# EAGLE design fullprop (EAGLE 8.1.0)
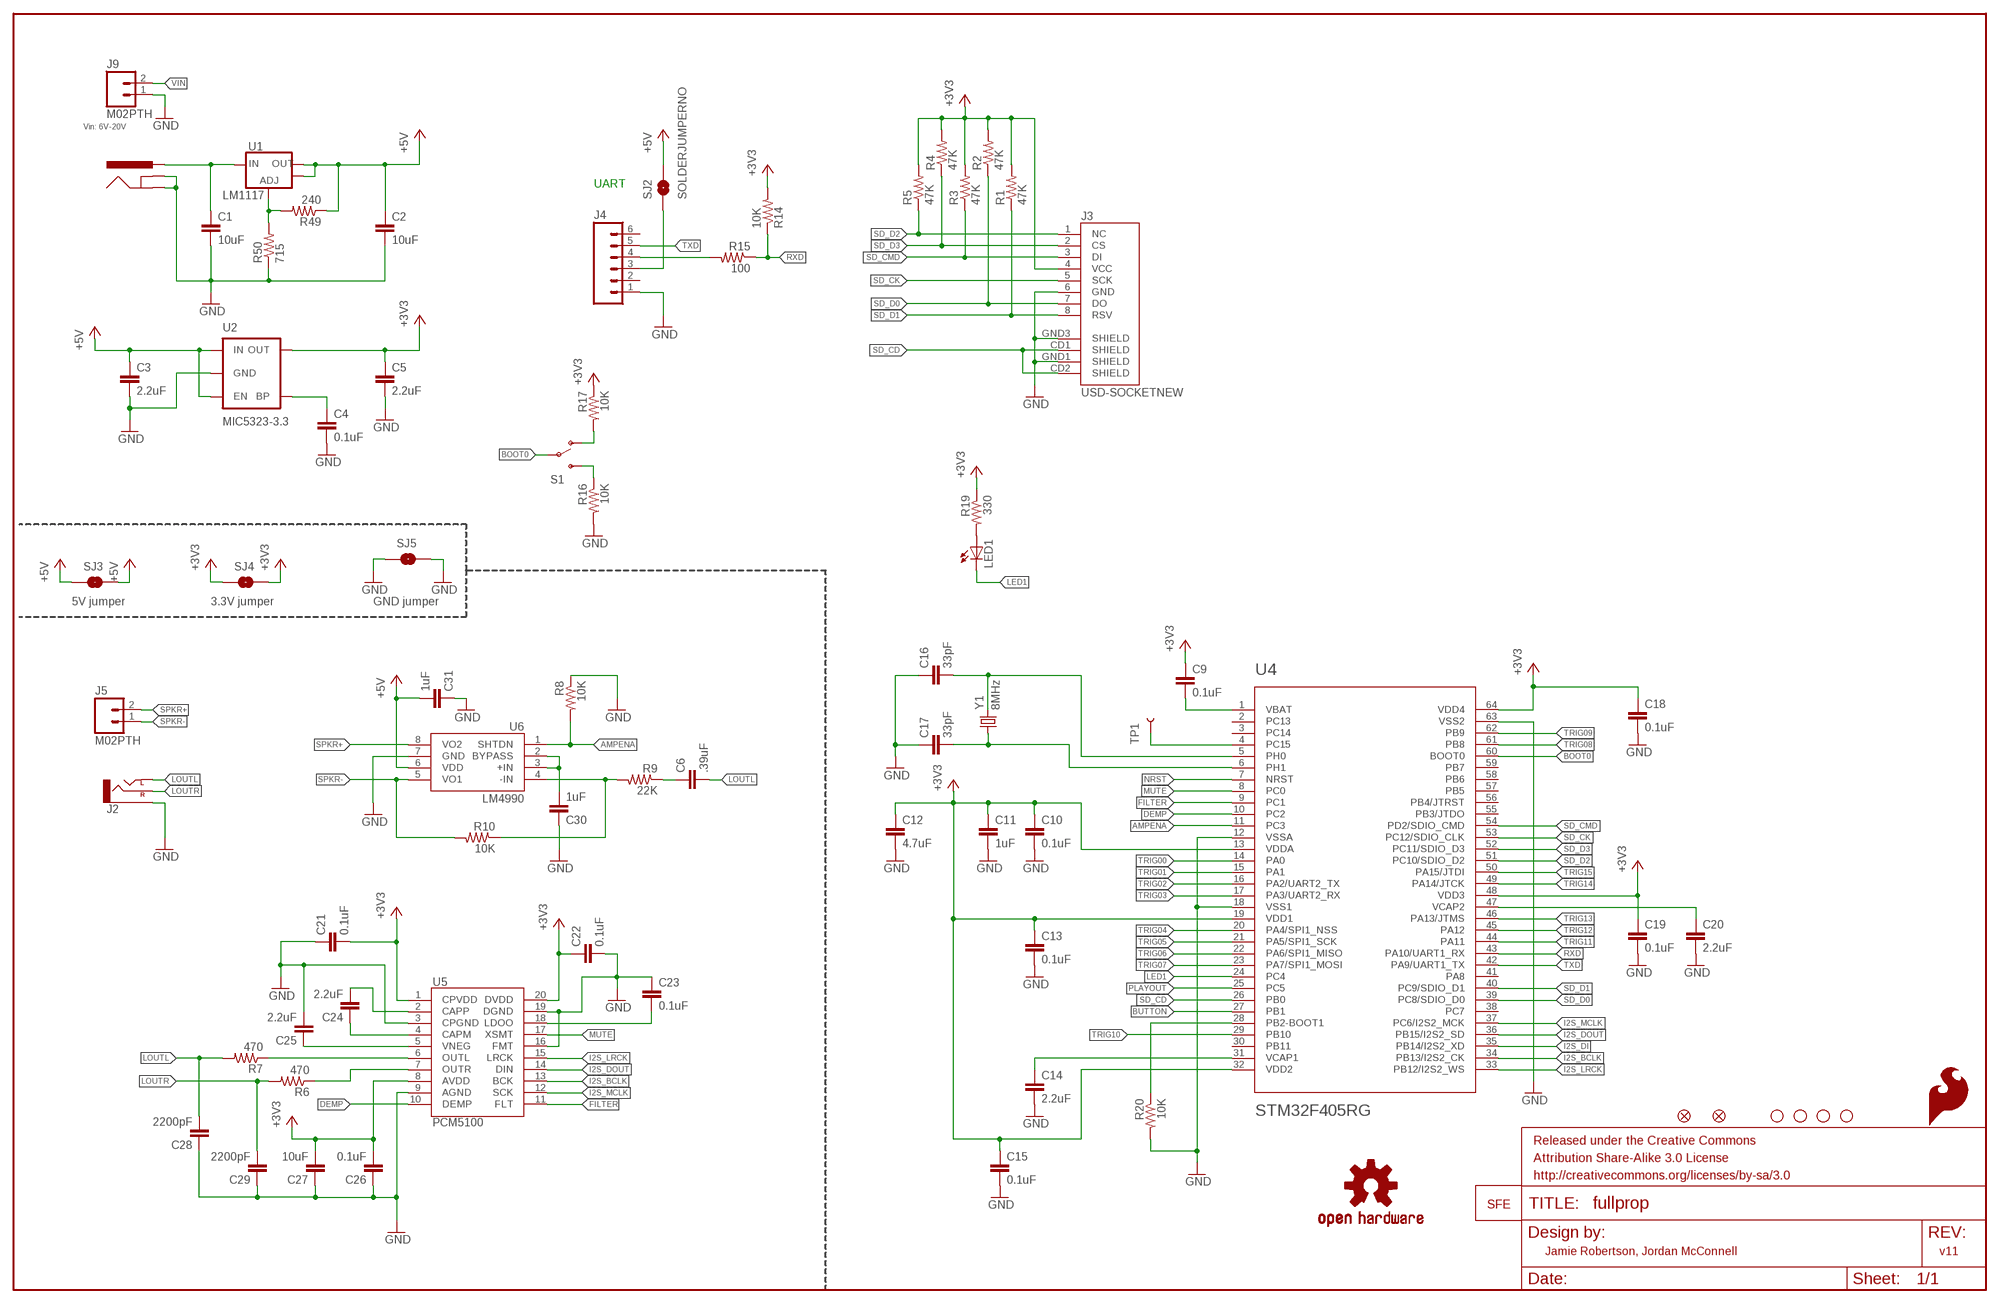
[diagram p0: schematic, sheet 1]

## Parts
C1  10uF  10UF50V20%(1210)  [1210]
C2  10uF  1UF-25V-10%(0805)  [0805]
C3  2.2uF  1UF-25V-10%(0805)  [0805]
C4  0.1uF  CAP0603-CAP  [0603-CAP]
C5  2.2uF  1UF-25V-10%(0805)  [0805]
C6  .39uF  CAP0603-CAP  [0603-CAP]
C9  0.1uF  CAP0603-CAP  [0603-CAP]
C10  0.1uF  CAP0603-CAP  [0603-CAP]
C11  1uF  CAP0603-CAP  [0603-CAP]
C12  4.7uF  CAP0603-CAP  [0603-CAP]
C13  0.1uF  CAP0603-CAP  [0603-CAP]
C14  2.2uF  CAP0603-CAP  [0603-CAP]
C15  0.1uF  CAP0603-CAP  [0603-CAP]
C16  33pF  CAP0603-CAP  [0603-CAP]
C17  33pF  CAP0603-CAP  [0603-CAP]
C18  0.1uF  CAP0603-CAP  [0603-CAP]
C19  0.1uF  CAP0603-CAP  [0603-CAP]
C20  2.2uF  CAP0603-CAP  [0603-CAP]
C21  0.1uF  CAP0603-CAP  [0603-CAP]
C22  0.1uF  CAP0603-CAP  [0603-CAP]
C23  0.1uF  CAP0603-CAP  [0603-CAP]
C24  2.2uF  CAP0603-CAP  [0603-CAP]
C25  2.2uF  CAP0603-CAP  [0603-CAP]
C26  0.1uF  CAP0603-CAP  [0603-CAP]
C27  10uF  CAP0603-CAP  [0603-CAP]
C28  2200pF  CAP0603-CAP  [0603-CAP]
C29  2200pF  CAP0603-CAP  [0603-CAP]
C30  1uF  CAP0603-CAP  [0603-CAP]
C31  1uF  CAP0603-CAP  [0603-CAP]
FID1  FIDUCIAL1X2  [FIDUCIAL-1X2]
FID2  FIDUCIAL1X2  [FIDUCIAL-1X2]
FRAME2  FRAME-LEDGER  [CREATIVE_COMMONS]
J1  5.5x2.1mm Barrel  POWER_JACKOVERPASTE_REDBOARD_0603  [POWER_JACK_SMD_OVERPASTE_REDBOARD_0603]
J2  AUDIO-JACKSMD2  [AUDIO-JACK-3.5MM-SMD]
J3  USD-SOCKETNEW  [MICRO-SD-SOCKET-PP]
J4  M06SIP  [1X06]
J5  M02PTH  [1X02]
J9  M02PTH  [1X02]
LED1  LED0603  [LED-0603]
LOGO1  OSHW-LOGOL  [OSHW-LOGO-L]
LOGO2  LOGO-SFENEW  [SFE-NEW-WEBLOGO]
LOGO4  SFE_LOGO_FLAME.2_INCH  [SFE_LOGO_FLAME_.2]
R1  47K  RESISTOR0603-RES  [0603-RES]
R2  47K  RESISTOR0603-RES  [0603-RES]
R3  47K  RESISTOR0603-RES  [0603-RES]
R4  47K  RESISTOR0603-RES  [0603-RES]
R5  47K  RESISTOR0603-RES  [0603-RES]
R6  470  RESISTOR0603-RES  [0603-RES]
R7  470  RESISTOR0603-RES  [0603-RES]
R8  10K  RESISTOR0603-RES  [0603-RES]
R9  22K  RESISTOR0603-RES  [0603-RES]
R10  10K  RESISTOR0603-RES  [0603-RES]
R14  10K  RESISTOR0603-RES  [0603-RES]
R15  100  RESISTOR0603-RES  [0603-RES]
R16  10K  RESISTOR0603-RES  [0603-RES]
R17  10K  RESISTOR0603-RES  [0603-RES]
R19  330  RESISTOR0603-RES  [0603-RES]
R20  10K  RESISTOR0603-RES  [0603-RES]
R49  240  240OHM1/10W1%(0603)  [0603-RES]
R50  715  RESISTOR0603  [0603-RES]
S1  SWITCH-SPDT-SMD-A  [SWITCH-SPST-SMD-A]
SJ2  SOLDERJUMPERNO  [SJ_2S-NO]
SJ3  SOLDERJUMPERTRACE  [SJ_2S-TRACE]
SJ4  SOLDERJUMPERTRACE  [SJ_2S-TRACE]
SJ5  SOLDERJUMPERTRACE  [SJ_2S-TRACE]
STANDOFF1  STAND-OFF  [STAND-OFF]
STANDOFF2  STAND-OFF  [STAND-OFF]
STANDOFF3  STAND-OFF  [STAND-OFF]
STANDOFF4  STAND-OFF  [STAND-OFF]
TP1  TEST-POINTTP_15TH_THRU  [TP_15TH]
U1  V_REG_LM1117SOT223  [SOT223]
U2  MIC5323-3.3  MIC52053.3V  [SOT23-5]
U4  STM32F405RG  [TQFP64]
U5  PCM5100  [PW_R-PDSO-G20]
U6  LM4990  [S-PDSO-G08]
Y1  8MHz  CRYSTALSMD  [HC49UP]

## Nets
+5V: C2.1 C3.1 C31.2 R49.1 SJ2.2 SJ3.1 SJ3.2 U1.2(OUT) U1.4(OUT) U2.1(IN) U2.3(EN) U6.6(VDD)
AMPENA: R8.2 U4.11(PC3) U6.1(SHTDN)
BOOT0: S1.2(P) U4.60(BOOT0)
BUTTON: U4.27(PB1)
DEMP: U4.10(PC2) U5.10(DEMP)
FILTER: U4.9(PC1) U5.11(FLT)
GND: C1.2 C2.2 C3.2 C4.2 C5.2 C10.2 C11.2 C12.2 C13.2 C14.2 C15.2 C16.1 C17.1 C18.2 C19.2 C20.2 C21.1 C22.2 C23.1 C25.2 C26.1 C27.1 C28.1 C29.1 C30.1 C31.1 J1.GND(GNDBREAK) J1.P$4(GND) J2.SLEEVE J3.6(GND) J3.GND1(SHIELD) J3.GND3(SHIELD) J4.1 J9.1 R8.1 R16.2 R20.2 R50.1 SJ5.1 SJ5.2 U2.2(GND) U4.12(VSSA) U4.18(VSS1) U4.63(VSS2) U5.3(CPGND) U5.9(AGND) U5.16(FMT) U5.19(DGND) U6.7(GND)
I2S_BCLK: U4.34(PB13/I2S2_CK) U5.13(BCK)
I2S_DI: U4.35(PB14/I2S2_XD)
I2S_DOUT: U4.36(PB15/I2S2_SD) U5.14(DIN)
I2S_LRCK: U4.33(PB12/I2S2_WS) U5.15(LRCK)
I2S_MCLK: U4.37(PC6/I2S2_MCK) U5.12(SCK)
LED1: LED1.C U4.24(PC4)
LOUTL: C6.2 C28.2 J2.TIP(LEFT) R7.2
LOUTR: C29.2 J2.RING(RIGHT) R6.2
MUTE: U4.8(PC0) U5.17(XSMT)
N$2: C4.1 U2.4(BP)
N$3: C9.2 U4.1(VBAT)
N$4: C14.1 U4.31(VCAP1)
N$5: C16.2 U4.5(PH0) Y1.2
N$6: C17.2 U4.6(PH1) Y1.1
N$7: R16.1 S1.3(S)
N$8: C20.1 U4.47(VCAP2)
N$9: J4.4 R15.2
N$10: R17.2 S1.1(O)
N$11: LED1.A R19.2
N$12: R20.1 U4.28(PB2-BOOT1)
N$13: R49.2 R50.2 U1.1(ADJ)
N$14: C23.2 U5.18(LDOO)
N$15: R6.1 U5.7(OUTR)
N$16: C24.2 U5.2(CAPP)
N$17: C24.1 U5.4(CAPM)
N$18: C25.1 U5.5(VNEG)
N$19: R7.1 U5.6(OUTL)
N$20: C30.2 U6.2(BYPASS) U6.3(+IN)
N$21: C6.1 R9.1
N$22: TP1.P$1 U4.4(PC15)
N$29: R9.2 R10.1 U6.4(-IN)
N$32: J4.3 SJ2.1
NRST: U4.7(NRST)
PLAYOUT: U4.25(PC5)
RXD: R14.1 R15.1 U4.43(PA10/UART1_RX)
SD_CD: J3.CD1(SHIELD) J3.CD2(SHIELD) U4.26(PB0)
SD_CK: J3.5(SCK) U4.53(PC12/SDIO_CLK)
SD_CMD: J3.3(DI) R3.1 U4.54(PD2/SDIO_CMD)
SD_D0: J3.7(DO) R2.1 U4.39(PC8/SDIO_D0)
SD_D1: J3.8(RSV) R1.1 U4.40(PC9/SDIO_D1)
SD_D2: J3.1(NC) R5.1 U4.51(PC10/SDIO_D2)
SD_D3: J3.2(CS) R4.1 U4.52(PC11/SDIO_D3)
SPKR+: J5.2 U6.8(VO2)
SPKR-: J5.1 R10.2 U6.5(VO1)
TRIG00: U4.14(PA0)
TRIG01: U4.15(PA1)
TRIG02: U4.16(PA2/UART2_TX)
TRIG03: U4.17(PA3/UART2_RX)
TRIG04: U4.20(PA4/SPI1_NSS)
TRIG05: U4.21(PA5/SPI1_SCK)
TRIG06: U4.22(PA6/SPI1_MISO)
TRIG07: U4.23(PA7/SPI1_MOSI)
TRIG08: U4.61(PB8)
TRIG09: U4.62(PB9)
TRIG10: U4.29(PB10)
TRIG11: U4.44(PA11)
TRIG12: U4.45(PA12)
TRIG13: U4.46(PA13/JTMS)
TRIG14: U4.49(PA14/JTCK)
TRIG15: U4.50(PA15/JTDI)
TXD: J4.5 U4.42(PA9/UART1_TX)
VCC: C5.1 C9.1 C10.1 C11.1 C12.1 C13.1 C15.1 C18.1 C19.1 C21.2 C22.1 C26.2 C27.2 J3.4(VCC) R1.2 R2.2 R3.2 R4.2 R5.2 R14.2 R17.1 R19.1 SJ4.1 SJ4.2 U2.5(OUT) U4.13(VDDA) U4.19(VDD1) U4.32(VDD2) U4.48(VDD3) U4.64(VDD4) U5.1(CPVDD) U5.8(AVDD) U5.20(DVDD) ; supply symbol labelled +3V3
VIN: C1.1 J1.VIN0(PWR) J9.2 U1.3(IN)
Unconnected: J4.2 J4.6 U4.2(PC13) U4.3(PC14) U4.30(PB11) U4.38(PC7) U4.41(PA8) U4.55(PB3/JTDO) U4.56(PB4/JTRST) U4.57(PB5) U4.58(PB6) U4.59(PB7)

## Notes on the sheet
- Vin: 6V-20V
- UART
- LM1117
- 5V jumper | 3.3V jumper | GND jumper
- Jamie Robertson, Jordan McConnell | v11

## Library data of the parts
C1 = SparkFun-Capacitors:10UF50V20%(1210): CAP-09824; PROD_ID: CAP-09824
C2 C3 C5 = SparkFun-Capacitors:1UF-25V-10%(0805): CAP-08064; PROD_ID: CAP-08064; VALUE: 1uF
C4 C6 C9-C31 = SparkFun-Capacitors:CAP: Capacitor Standard 0603 ceramic capacitor, and 0.1" leaded capacitor.
FID1 FID2 = SparkFun-Aesthetics:FIDUCIAL: Fiducial Alignment Points Various fiducial points for machine vision alignment.
FRAME2 = SparkFun-Aesthetics:FRAME-LEDGER: Schematic Frame Standard 11x14 US Ledger frame
J1 = Testing:POWER_JACK: Power Jack This is the standard 5.5mm barrel jack for power. The PTH is the most common, proven, reliable, footprint. All others are experimental. The Slot footprint only works if the mill layer is transmitted to the PCB fab house so be warned. Spark Fun Electronics SKU : PRT-00119. Mating wall wart : TOL-00298 (and others)
J2 = SparkFun-Connectors:AUDIO-JACK: 3.5mm Audio Jack Simple 3.5mm common PCB mount audio jack. SKU: PRT-08032
J3 = robertsonics:USD-SOCKET: microSD Socket Push-push type uSD socket. Schematic element and footprint production proven. Spark Fun Electronics SKU : PRT-00127. tDoc lines correctly indicate media card edge positions when inserting (unlocked, locked, depressed).
J4 = SparkFun-Connectors:M06: Header 6 Standard 6-pin 0.1" header. Use with straight break away headers (SKU : PRT-00116), right angle break away headers (PRT-00553), swiss pins (PRT-00743), machine pins (PRT-00117), and female headers (PRT-00115). Molex polarized connector foot print use with SKU : PRT-08094 with associated crimp pins and housings. NOTES ON THE VARIANTS LOCK and LOCK_LONGPADS... This footprint was designed to help hold the alignment of a through-hole component (i.e. 6-pin header) while soldering it into place. You may notice that each hole has been shifted either up or down by 0.005 of an inch from it's more standard position (which is a perfectly straight line). This slight alteration caused the pins (the squares in the middle) to touch the edges of the holes. Because they are alternating, it causes a "brace" to hold the component in place. 0.005 has proven to be the perfect amount of "off-center" position when using our standard breakaway headers. Although looks a little odd when you look at the bare footprint, once you have a header in there, the alteration is very hard to notice. Also, if you push a header all the way into place, it is covered up entirely on the bottom side. This idea of altering the position of holes to aid alignment will be further integrated into the Sparkfun Library for other footprints. It can help hold any component with 3 or more connection pins.
J5 J9 = SparkFun-Connectors:M02: Standard 2-pin 0.1" header. Use with - straight break away headers ( PRT-00116) - right angle break away headers (PRT-00553) - swiss pins (PRT-00743) - machine pins (PRT-00117) - female headers (PRT-00115) Molex polarized connector foot print use with: PRT-08233 with associated crimp pins and housings. 2.54_SCREWTERM for use with PRT-10571. 3.5mm Screw Terminal footprints for PRT-08084 5mm Screw Terminal footprints for use with PRT-08433
LED1 = SparkFun-LED:LED: LEDs Standard schematic elements and footprints for 5mm, 3mm, 1206, and 0603 sized LEDs. 5mm - Spark Fun Electronics SKU : COM-00529 (and others)
LOGO1 = SparkFun-Aesthetics:OSHW-LOGO: Open Source Hardware Logo This logo indicates the piece of hardware it is found on incorporates a OSHW license and/or adheres to the definition of open source hardware found here: http://freedomdefined.org/OSHW
LOGO2 = SparkFun-Aesthetics:LOGO-SFE: Spark Fun Electronics PCB Logo This is the standard Spark Fun Electronics PCB logo.
LOGO4 = SparkFun-Aesthetics:SFE_LOGO_FLAME: SFE Logo, flame only This is the SparkFun flame logo. The logo on the schematic will always be the same size; the package variant is the height of the flame. Default layer for the logo on the board is tSilk.
R1-R10 R14-R17 R19 R20 = SparkFun-Passives:RESISTOR: Resistor Basic schematic elements and footprints for 0603, 1206, and PTH resistors.
R49 = SparkFun-Resistors:240OHM1/10W1%(0603): RES-07849; PROD_ID: RES-07849
R50 = SparkFun-Resistors:RESISTOR: Resistor Basic schematic elements and footprints for 0603, 1206, and PTH resistors.
S1 = SparkFun-Electromechanical:SWITCH-SPDT: SPDT Switch Simple slide switch, Spark Fun Electronics SKU : COM-00102 DPDT SMT slide switch, AYZ0202, SWCH-08179
SJ2-SJ5 = SparkFun-Passives:SOLDERJUMPER: Solder Jumper Standard SMD solder jumper. Used to automate production. Two varients : Normally Open and Normally Closed are the same, but have different paste layers. NC will have a large amount of paste and should jumper during reflow.
STANDOFF1-STANDOFF4 = SparkFun-Electromechanical:STAND-OFF: #4 Stand Off This is the mechanical footprint for a #4 phillips button head screw. Use the keepout ring to avoid running the screw head into surrounding components. SKU : PRT-00447
TP1 = SparkFun-Passives:TEST-POINT: Bare copper test points for troubleshooting or ICT
U1 = SparkFun-PowerIC:V_REG_LM1117: Voltage Regulator LM1117 Standard adjustable voltage regulator but in SMD form. Spark Fun Electronics SKU : COM-00595
U2 = SparkFun-PowerIC:MIC5205: MIC5205 150mA vreg 3.3V - VREG-00822 5V - VREG-00823; PROD_ID: VREG-00822
U4 = SparkFun-DigitalIC:STM32F405RG: ARM DSP Chip used on the WAV Trigger board.
U5 = robertsonics:PCM5100: PCM5100 Stereo DAC
U6 = robertsonics:LM4990: LM4990 2 Watt Audio Amp
Y1 = SparkFun-FreqCtrl:CRYSTAL: Various standard crystals. Proven footprints. Spark Fun Electronics SKU : COM-00534

## Board
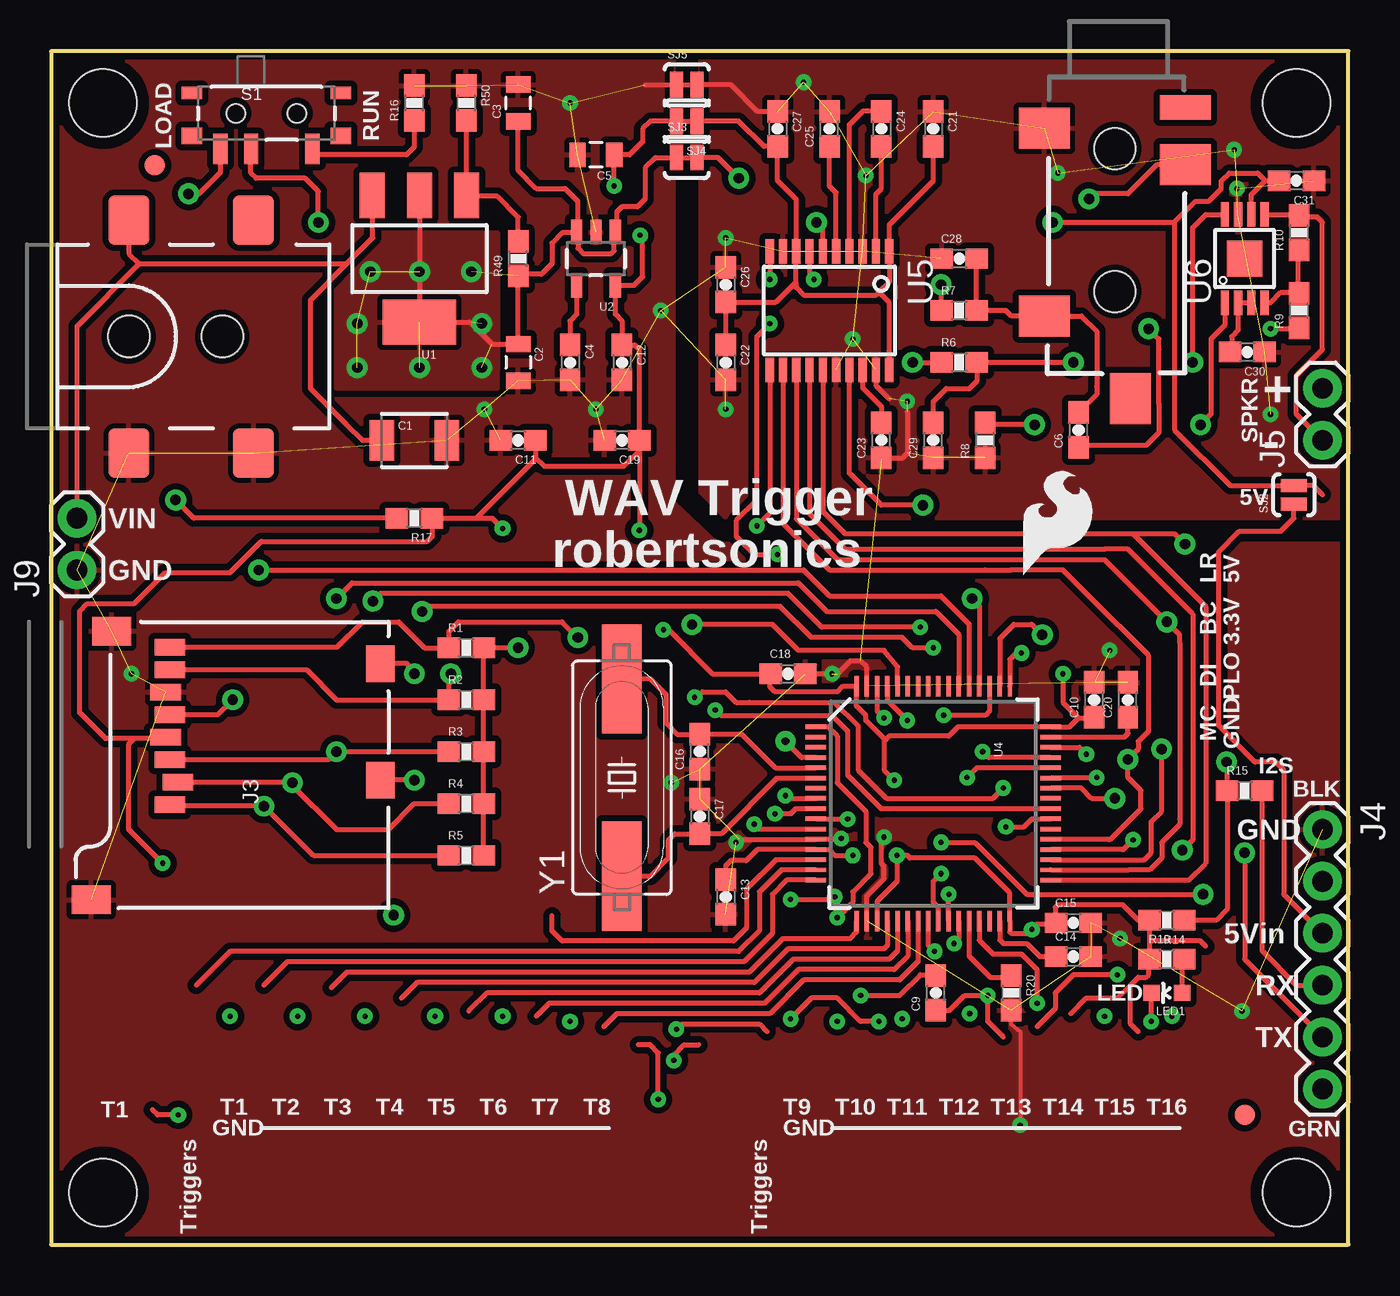
[diagram p1: board, top side]
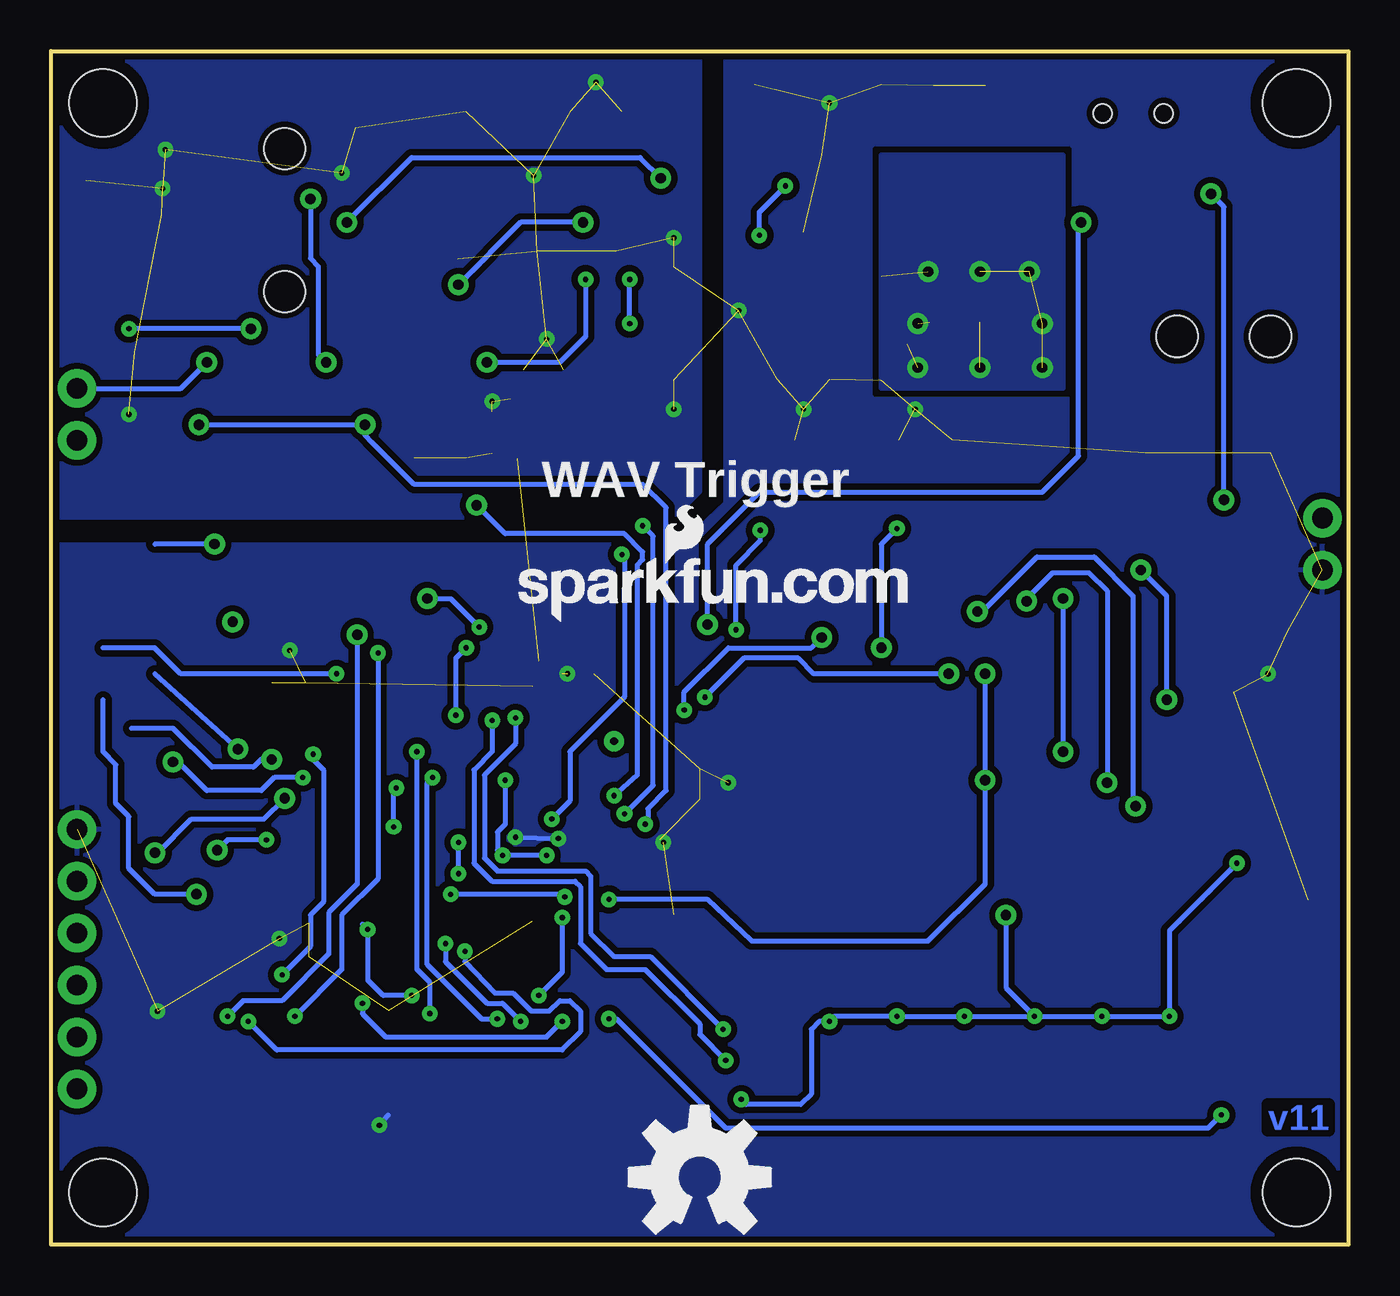
[diagram p2: board, bottom side, seen from below]

Size 63.5 x 58.42 mm. Coordinates in mm from the lower left corner, seen from the top.
Outline: 0,0 63.5,0 63.5,58.42 0,58.41 0,0
Copper layers (1*16): Top 0.035mm / dielectric 1.5mm / Bottom 0.035mm
Design rules "SparkFun": minimum track width 8mil, minimum drill 20mil, track to track 8mil, track to pad 8mil, pad to pad 8mil, via to via 8mil, smd to smd 8mil, copper to edge 8mil, drill to drill 8mil, minimum pad ring 12mil, minimum via ring 10mil, stop-mask expansion 4mil, vias tented up to drill 20mil, thermal gap 10mil

### Footprints (pad centres in the part's own frame; a part is rotated, then mirrored left to right if it is on the bottom)
1210 = smd 1.2 x 2: 1 -1.6,0; 2 1.6,0
0805 = smd 0.8 x 1.2: 1 -0.9,0; 2 0.9,0
0603-CAP = smd 1.1 x 1: 1 -0.85,0; 2 0.85,0
FIDUCIAL-1X2 = smd 1 x 1: 1 0,0
POWER_JACK_SMD_OVERPASTE_REDBOARD_0603 = smd 2 x 2.4: GND 0,-5.7; P$4 6.1,-5.7; VIN0 0,5.7; VIN1 6.1,5.7 | hole 2.032: 0,0; 4.572,0
AUDIO-JACK-3.5MM-SMD = smd 2 x 2.5: RING 4.3,3.45; SLEEVE 2.5,-3.45; TIP 11.7,-3.45 | smd 1.2 x 2.5: RSH 1.5,3.45 | smd 2.5 x 2: TSH 15.75,0.75 | hole 2: 3.5,0; 10.5,0
MICRO-SD-SOCKET-PP = smd 0.8 x 1.5: 1 -8.94,10.7; 2 -7.84,10.3; 3 -6.74,10.7; 4 -5.64,10.9; 5 -4.54,10.7; 6 -3.44,10.9; 7 -2.34,10.7; 8 -1.24,10.7 | smd 1.8 x 1.4: CD1 -2.05,0.4; CD2 -7.75,0.4 | smd 1.4 x 1.9: GND1 -13.6,14.55; GND3 -0.45,13.55
1X06 = drill 1.016 pad 1.88: 1 0,0; 2 2.54,0; 3 5.08,0; 4 7.62,0; 5 10.16,0; 6 12.7,0
1X02 = drill 1.016 pad 1.88: 1 0,0; 2 2.54,0
LED-0603 = smd 0.8 x 0.8: A 0,-0.75; C 0,0.75
0603-RES = smd 1.1 x 1: 1 -0.85,0; 2 0.85,0
SWITCH-SPST-SMD-A = smd 0.7 x 1.5: 1 -2.25,-1.75; 2 -0.75,-1.75; 3 2.25,-1.75 | smd 1 x 0.6: GND1 -3.65,1; GND3 3.65,1 | smd 1 x 0.8: GND2 -3.65,-1.1; GND4 3.65,-1.1 | hole 0.9: -1.5,0; 1.5,0
SJ_2S-NO = smd 0.635 x 1.27: 1 -0.45,0; 2 0.45,0
SJ_2S-TRACE = smd 0.635 x 1.27: 1 -0.508,0; 2 0.508,0
STAND-OFF = hole 3.302: 0,0
TP_15TH = drill 0.381 pad 0.61: P$1 0,0
SOT223 = smd 1.219 x 2.235: 1 -2.311,-3.099; 2 0,-3.099; 3 2.311,-3.099 | smd 3.6 x 2.2: 4 0,3.099
SOT23-5 = smd 0.55 x 1.2: 1 -0.95,-1.3; 2 0,-1.3; 3 0.95,-1.3; 4 0.95,1.3; 5 -0.95,1.3
TQFP64 = smd 0.22 x 1: 1 -3.75,-5.75; 2 -3.25,-5.75; 3 -2.75,-5.75; 4 -2.25,-5.75; 5 -1.75,-5.75; 6 -1.25,-5.75; 7 -0.75,-5.75; 8 -0.25,-5.75; 9 0.25,-5.75; 10 0.75,-5.75; 11 1.25,-5.75; 12 1.75,-5.75; 13 2.25,-5.75; 14 2.75,-5.75; 15 3.25,-5.75; 16 3.75,-5.75; 33 3.75,5.75; 34 3.25,5.75; 35 2.75,5.75; 36 2.25,5.75; 37 1.75,5.75; 38 1.25,5.75; 39 0.75,5.75; 40 0.25,5.75; 41 -0.25,5.75; 42 -0.75,5.75; 43 -1.25,5.75; 44 -1.75,5.75; 45 -2.25,5.75; 46 -2.75,5.75; 47 -3.25,5.75; 48 -3.75,5.75 | smd 1 x 0.22: 17 5.75,-3.75; 18 5.75,-3.25; 19 5.75,-2.75; 20 5.75,-2.25; 21 5.75,-1.75; 22 5.75,-1.25; 23 5.75,-0.75; 24 5.75,-0.25; 25 5.75,0.25; 26 5.75,0.75; 27 5.75,1.25; 28 5.75,1.75; 29 5.75,2.25; 30 5.75,2.75; 31 5.75,3.25; 32 5.75,3.75; 49 -5.75,3.75; 50 -5.75,3.25; 51 -5.75,2.75; 52 -5.75,2.25; 53 -5.75,1.75; 54 -5.75,1.25; 55 -5.75,0.75; 56 -5.75,0.25; 57 -5.75,-0.25; 58 -5.75,-0.75; 59 -5.75,-1.25; 60 -5.75,-1.75; 61 -5.75,-2.25; 62 -5.75,-2.75; 63 -5.75,-3.25; 64 -5.75,-3.75
PW_R-PDSO-G20 = smd 0.4 x 1.2: 1 -2.925,-2.9; 2 -2.275,-2.9; 3 -1.625,-2.9; 4 -0.975,-2.9; 5 -0.325,-2.9; 6 0.325,-2.9; 7 0.975,-2.9; 8 1.625,-2.9; 9 2.275,-2.9; 10 2.925,-2.9; 11 2.925,2.9; 12 2.275,2.9; 13 1.625,2.9; 14 0.975,2.9; 15 0.325,2.9; 16 -0.325,2.9; 17 -0.975,2.9; 18 -1.625,2.9; 19 -2.275,2.9; 20 -2.925,2.9
S-PDSO-G08 = smd 0.4 x 1.2: 1 -0.975,-2.157; 2 -0.325,-2.157; 3 0.325,-2.157; 4 0.975,-2.157; 5 0.975,2.157; 6 0.325,2.157; 7 -0.325,2.157; 8 -0.975,2.157 | smd 1.73 x 1.78: TH 0,0
HC49UP = smd 5.334 x 1.93: 1 -4.826,0; 2 4.826,0

### Placement (x,y rotation side)
C1  17.78,39.37 0 top
C2  22.86,43.18 270 top
C3  22.86,55.88 90 top
C4  25.4,43.18 270 top
C5  26.67,53.34 180 top
C6  50.29,39.88 90 top
C9  43.31,12.32 90 top
C10  51.05,26.67 90 top
C11  22.86,39.37 180 top
C12  27.94,43.18 270 top
C13  33.02,17.02 270 top
C14  50.04,14.1 0 top
C15  50.04,15.75 0 top
C16  31.75,24.13 90 top
C17  31.75,20.95 270 top
C18  36.07,27.94 0 top
C19  27.94,39.37 180 top
C20  52.7,26.67 90 top
C21  43.18,54.61 270 top
C22  33.02,43.18 270 top
C23  40.64,39.37 90 top
C24  40.64,54.61 270 top
C25  38.1,54.61 90 top
C26  33.02,46.99 270 top
C27  35.56,54.61 270 top
C28  44.45,48.26 0 top
C29  43.18,39.37 90 top
C30  58.55,43.69 180 top
C31  60.96,52.07 180 top
FID1  5.08,52.83 0 top
FID2  58.42,6.35 0 top
FRAME2  17.78,-20.32 0 top  (outside the outline)
J1  3.81,44.45 0 top
J2  52.07,57.15 270 top
J3  16.51,30.48 90 top
J4  62.23,20.32 270 top
J5  62.23,39.37 90 top
J9  1.27,33.02 90 top
LED1  54.61,12.32 90 top
LOGO1  31.75,3.3 0 bottom
LOGO2  40.64,30.48 0 bottom
LOGO4  47.24,32.51 0 top
R1  20.32,29.21 0 top
R2  20.32,26.67 0 top
R3  20.32,24.13 0 top
R4  20.32,21.59 0 top
R5  20.32,19.05 0 top
R6  44.45,43.18 0 top
R7  44.45,45.72 0 top
R8  45.72,39.37 90 top
R9  61.09,45.72 90 top
R10  61.09,49.53 90 top
R14  54.61,15.88 180 top
R15  58.42,22.23 0 top
R16  17.78,55.88 90 top
R17  17.78,35.56 180 top
R19  54.61,13.97 0 top
R20  46.99,12.32 270 top
R49  22.86,48.26 90 top
R50  20.32,55.88 270 top
S1  10.54,55.37 0 top
SJ2  60.83,36.7 90 top
SJ3  31.11,53.21 0 top
SJ4  31.11,54.99 180 top
SJ5  31.11,56.77 0 top
STANDOFF1  2.54,2.54 0 top
STANDOFF2  60.96,2.54 0 top
STANDOFF3  2.54,55.88 0 top
STANDOFF4  60.96,55.88 0 top
TP1  35.94,24.64 0 top
U1  18.03,48.26 180 top
U2  26.67,48.26 180 top
U4  43.18,21.59 270 top
U5  38.1,45.72 180 top
U6  58.42,48.26 0 top
Y1  27.94,22.86 90 top

### Tracks (layer width: path | path; a pad name or v marks a point on that pad's centre or on a via)
+5V  (via drill 0.51)  (7 unrouted)
  Top 0.254: U6.6 58.74,51.38 59.44,52.07 | 54.99,50.04 56.01,51.05 56.64,51.05 57.28,51.69 57.28,52.07 57.66,52.45 59.05,52.45 59.44,52.07 | 54.99,50.04 54.99,39.88 57.72,37.15 SJ2.2 | v49.02,50.04 54.99,50.04 | 25.78,49.62 U2.3 25.69,49.53 25.02,49.53 24.51,49.02 24.51,48.01 24,47.5 22.95,47.5 R49.1 C2.1 21.59,44.07 20.5,45.16 U1.4 v18.03,47.62 U1.2 | 25.78,49.62 25.78,51.05 25.15,51.69 23.75,51.69 22.86,52.58 C3.1 | 25.78,49.62 25.78,48.77 26.04,48.51 27.43,48.51 27.56,48.64 27.56,49.5 U2.1 27.69,49.63 27.69,50.55 27.94,50.8 28.7,50.8 29.08,51.18 29.08,52.7 29.59,53.21 SJ3.1 SJ3.2 32.64,53.21 v33.66,52.2 | 60.76,37.08 SJ2.2 | 60.89,37.21 SJ2.2 | 62.23,36.7 61.78,37.15 SJ2.2 | 59.44,52.07 C31.2
  Bottom 0.254: v49.02,50.04 45.85,53.21 34.67,53.21 v33.66,52.2
  other vias: 15.62,47.62 20.57,47.62 14.99,42.93 18.03,42.93 21.08,42.93 14.99,45.09 21.08,45.09
  pour Top (isolate 0.305): 13.97,49.53 21.84,49.53 21.84,41.91 13.97,41.91
  pour Bottom (isolate 0.305): 13.97,41.91 22.86,41.91 22.86,53.34 13.97,53.34
AMPENA  (via drill 0.25, 0.51)
  Top 0.254: U6.1 57.45,45 56.77,44.32 56.77,40.64 v56.26,40.13 | v34.42,20.57 34.65,20.34 U4.11 | v48.13,40.13 45.81,40.13 R8.2
  Bottom 0.254: v34.42,20.57 34.29,20.7 34.29,21.34 33.4,22.23 33.4,36.07 34.54,37.21 44.83,37.21 45.72,37.21 47.75,39.24 48.13,39.62 v48.13,40.13 v56.26,40.13
BOOT0  (via drill 0.51)
  Top 0.254: v31.37,30.35 35.31,30.35 36.58,29.08 40.77,29.08 41.43,28.29 U4.60 | S1.2 9.78,52.45 10.03,52.2 12.45,52.2 13.08,51.56 v13.08,50.04
  Bottom 0.254: v31.37,30.35 31.37,34.29 28.83,36.83 14.99,36.83 13.21,38.61 13.21,49.91 v13.08,50.04
BUTTON  (via drill 0.25)
  Top 0.254: U4.27 44.43,14.97 v44.2,14.73 | v40.51,10.92 39.62,10.92 38.48,12.06 37.21,12.06 v36.2,11.05 | v6.22,6.35 5.21,6.35 4.95,6.6
  Bottom 0.254: v44.2,14.73 44.2,13.84 42.16,11.81 41.4,11.81 v40.51,10.92 | v36.2,11.05 35.81,11.05 30.48,5.71 6.86,5.71 v6.22,6.35
DEMP  (via drill 0.25)
  Top 0.254: U5.10 v35.17,47.25 v35.18,47.24 | v35.18,45.09 34.54,44.45 34.54,36.45 33.53,35.43 33.53,34.67 34.42,33.78 v35.56,33.78 | U4.10 38.98,20.84 v38.99,20.83
  Bottom 0.254: v35.18,45.09 v35.18,47.24 | v35.56,33.78 35.43,33.66 35.43,26.8 38.1,24.13 38.1,21.72 v38.99,20.83
FILTER  (via drill 0.25)
  Top 0.254: U5.11 35.17,35.81 v34.54,35.18 | v35.43,21.08 36.2,21.08 36.45,21.34 U4.9
  Bottom 0.254: v35.43,21.08 34.04,22.48 34.04,34.67 v34.54,35.18
GND  (via drill 0.25)  (64 unrouted)
  Top 0.203: R20.2 46.99,10.79 47.43,10.41 v47.43,5.84
  Top 0.254: C27.1 34.58,55.46 33.27,56.77 SJ5.2 SJ5.1 29.08,56.77 | U4.63 39.93,28.27 39.62,28.57 39.12,28.57 38.48,27.94 C18.2 | U4.18 39.93,17.07 40.77,17.91 40.77,18.54 40.64,18.67 40.64,19.81 v40.77,19.94 | U5.19 40.38,42.05 41.02,41.4 | 41.91,40.77 41.91,38.73 41.66,38.48 40.68,38.48 C23.1 | v33.53,19.68 33.68,19.84 U4.12 38.64,19.84 v38.67,19.88
  Bottom 0.254: v47.43,5.84 46.99,6.35 | v40.77,19.94 v38.67,19.88
  other vias: 30.35,22.61 58.04,51.69 57.91,53.59 59.69,40.64 39.88,52.32 33.02,49.28 33.02,40.89 41.91,41.27 51.82,29.08 58.29,11.43 52.32,14.99 38.23,27.94 3.94,27.94 29.84,45.72 39.24,44.32 26.67,40.89 21.21,40.89 25.4,55.88 36.83,56.9 49.28,52.45
  pour Bottom (isolate 0.305, rank 2): 0,58.42 0,0 63.5,0 63.5,34.29 32.64,34.29 30.48,36.32 30.48,58.42
  pour Top (isolate 0.305, rank 2): 0,58.42 0,0 63.5,0 63.5,34.29 32.64,34.29 30.48,36.32 30.48,58.42
  pour Top (isolate 0.305): 31.75,58.42 31.75,36.83 33.02,35.56 63.5,35.56 63.5,58.42
  pour Bottom (isolate 0.305): 31.75,58.42 31.75,36.83 33.02,35.56 63.5,35.56 63.5,58.42
I2S_BCLK  (via drill 0.51)
  Top 0.254: U5.13 36.48,35.53 38.48,33.53 51.18,33.53 51.56,33.53 v54.61,30.48 55.24,29.84 55.24,29.46 55.24,20.83 55.24,20.57 54.36,19.68 54.36,18.92 53.77,18.34 52.76,18.34 U4.34
I2S_DI  (via drill 0.51)
  Top 0.254: U4.35 53.51,18.84 53.85,19.18 53.85,20.7 54.36,21.21 v54.36,24.26
  Bottom 0.254: v54.36,24.26 58.42,27.94
I2S_DOUT  (via drill 0.25, 0.51)
  Top 0.254: U5.14 37.12,35.77 38.86,34.04 51.56,34.04 52.7,34.04 55.88,30.86 55.88,19.81 v55.37,19.3 | U4.36 52.41,19.34 52.49,19.34 v52.96,19.81
  Bottom 0.254: v52.96,19.81 54.86,19.81 v55.37,19.3
I2S_LRCK  (via drill 0.51)
  Top 0.254: U5.15 37.77,35.88 38.86,34.8 52.96,34.8 | 52.96,34.8 56.52,31.24 56.52,18.67 55.69,17.84 U4.33 | 52.96,34.8 53.85,34.8 54.99,34.8 v55.5,34.29
  Bottom 0.254: v55.5,34.29 58.42,34.29
I2S_MCLK  (via drill 0.51)
  Top 0.254: U5.12 35.83,35.3 38.1,33.02 45.72,33.02 46.99,33.02 49.53,33.02 50.8,31.75 53.72,28.83 53.72,25.15 53.21,24.64 53.21,24.26 v52.7,23.75 52.7,22.86 53.34,22.23 53.34,21.34 51.84,19.84 51.72,19.84 U4.37
  Bottom 0.254: v52.7,23.75 53.21,23.75 53.59,23.37 55.63,23.37 57.53,25.27 59.56,25.27
LED1  (via drill 0.25)
  Top 0.254: v53.85,10.92 53.85,12.31 LED1.C | U4.24 42.93,14.66 v43.24,14.35
  Bottom 0.254: v43.24,14.35 43.24,13.84 41.78,12.32 40.89,12.32 40.01,11.43 39.12,11.43 38.61,11.94 38.1,11.94 37.59,11.43 37.59,10.41 38.48,9.53 52.45,9.53 v53.85,10.92
LOUTL
  Top 0.254: C28.2 R7.2 46.74,45.72 47.01,45.45 J2.TIP 50.44,45.45 51.18,44.7 51.18,42 51.18,41.62 C6.2
LOUTR  (via drill 0.51)
  Top 0.254: C29.2 43.18,41.27 43.81,41.91 44.96,41.91 45.34,42.29 45.34,43.14 R6.2 v50.04,43.18 | J2.RING 54.12,52.85 52.7,51.44 51.05,51.44 v50.8,51.18
  Bottom 0.254: v50.8,51.18 50.8,48.26 50.42,47.88 50.42,43.56 v50.04,43.18
MUTE  (via drill 0.25, 0.51)
  Top 0.254: 39.12,42.78 U5.17 39.08,37.76 40.64,36.2 v42.67,36.2 | v35.94,21.97 36.07,21.84 U4.8
  Bottom 0.254: v35.94,21.97 34.8,22.99 34.8,33.27 34.54,33.53 34.54,33.91 35.43,34.8 41.27,34.8 v42.67,36.2
N$2
  Top 0.254: U2.4 25.72,45.53 25.4,45.21 C4.1
N$3  (via drill 0.25)
  Top 0.254: v39.62,12.19 41.53,12.19 42.55,13.21 43.27,13.21 C9.2 | v38.48,16 39.24,16.76 39.24,17.27 40.13,18.16 40.13,19.43 39.88,19.68 39.88,21.21 38.48,22.61 38.48,24.89 38.03,25.34 U4.1
  Bottom 0.254: v38.48,16 38.48,13.34 v39.62,12.19
N$4
  Top 0.254: U4.31 46.43,14.91 46.61,14.73 47.75,14.73 48.39,14.1 C14.1
N$5
  Top 0.254: Y1.2 29.34,27.69 30.1,26.92 30.1,25.53 30.65,24.98 C16.2 33.82,24.98 35.46,23.34 U4.5
N$6
  Top 0.254: Y1.1 29.34,18.03 30.23,18.92 30.23,19.81 30.52,20.11 C17.2 32.8,20.11 35.54,22.84 U4.6
N$7
  Top 0.254: R16.1 17.78,53.72 17.4,53.34 13.07,53.34 S1.3
N$8
  Top 0.254: U4.47 52.53,24.84 52.7,25.02 C20.1
N$9
  Top 0.254: R15.2 59.27,14.39 60.96,12.7 J4.4
N$10  (via drill 0.51)
  Top 0.254: R17.2 6.99,35.56 v6.1,36.45 | v6.73,51.44 7.24,51.44 8.29,52.49 S1.1
  Bottom 0.254: v6.1,36.45 6.1,50.8 v6.73,51.44
N$11
  Top 0.254: LED1.A 55.36,13.87 R19.2
N$12
  Top 0.254: U4.28 44.93,14.12 45.97,13.08 46.9,13.08 R20.1
N$13
  Top 0.254: R49.2 22.86,50.29 21.84,51.31 20.4,51.31 U1.1 20.34,55.01 R50.2
N$14
  Top 0.254: U5.18 39.73,41.94 40.64,41.02 C23.2
N$15  (via drill 0.25, 0.51)
  Top 0.254: U5.7 37.12,47.46 v37.34,47.24 | v42.16,43.18 R6.1
  Bottom 0.254: v37.34,47.24 37.34,44.45 38.61,43.18 v42.16,43.18
N$16
  Top 0.254: U5.2 40.38,51.42 40.64,51.69 C24.2
N$17
  Top 0.254: U5.4 39.08,54.82 39.75,55.5 40.6,55.5 C24.1
N$18
  Top 0.254: U5.5 38.42,51.49 38.1,51.82 C25.1
N$19  (via drill 0.51)
  Top 0.254: U5.6 37.77,49.73 v37.47,50.04 | v43.56,46.99 43.56,45.76 R7.1
  Bottom 0.254: v37.47,50.04 40.51,50.04 v43.56,46.99
N$20
  Top 0.254: C30.2 57.78,43.78 57.78,44.45 58.09,44.76 U6.2 U6.3
N$21  (via drill 0.25, 0.51)
  Top 0.254: v59.69,44.83 61.05,44.83 R9.1 | v53.72,44.83 54.23,44.32 54.23,43.81 54.23,41.15 54.23,39.75 53.59,39.12 51.6,39.12 50.38,39.12 C6.1
  Bottom 0.254: v53.72,44.83 v59.69,44.83
N$22
  Top 0.254: U4.4 36.74,23.84 TP1.P$1
N$29
  Top 0.254: U6.4 59.69,46.1 60.2,46.61 61.05,46.61 | 61.05,46.61 R9.2 | 61.05,46.61 61.05,48.64 R10.1
N$32
  Top 0.254: J4.3 60.33,17.14 60.33,23.11 60.33,23.24 59.94,23.62 58.93,23.62 57.15,25.4 57.15,33.91 58.17,34.92 60.2,34.92 60.83,35.56 SJ2.1
PLAYOUT  (via drill 0.25, 0.51)
  Top 0.254: U4.25 43.43,16.51 43.18,16.76 43.18,17.78 v43.56,18.16 | v56.39,17.14 47.75,17.14 45.21,19.68 v43.56,19.68
  Bottom 0.254: v56.39,17.14 58.42,17.14 59.69,18.41 59.69,20.95 60.33,21.59 60.33,23.5 60.96,24.13 60.96,26.67 | v43.56,18.16 v43.56,19.68
RXD  (via drill 0.25, 0.51)
  Top 0.254: R14.1 57.02,15.88 57.57,16.42 R15.1 57.57,23.58 v57.53,23.62 | v51.18,22.86 51.16,22.84 U4.43
  Bottom 0.254: v57.53,23.62 57.28,23.62 56.52,22.86 55.88,22.23 53.21,22.23 52.58,22.86 v51.18,22.86
SD_CD  (via drill 0.25, 0.51)
  Top 0.254: v17.78,27.94 17.78,28.07 17.4,28.45 16.13,28.45 J3.CD1 | v36.2,16.89 38.23,16.89 v38.35,17.02 | U4.26 43.93,17.01 v43.94,17.14 | v17.78,22.73 J3.CD2
  Bottom 0.254: v36.2,16.89 31.37,16.89 29.21,14.86 20.57,14.86 17.78,17.65 v17.78,22.73 v17.78,27.94 | v38.35,17.02 38.48,17.14 v43.94,17.14
SD_CK  (via drill 0.51)
  Top 0.254: J3.5 8.16,25.94 v8.89,26.67 | v10.16,33.02 36.83,33.02 38.1,31.75 43.56,31.75 44.93,30.38 U4.53
  Bottom 0.254: v8.89,26.67 8.89,31.75 v10.16,33.02
SD_CMD  (via drill 0.51)
  Top 0.254: J3.3 13.58,23.74 v13.97,24.13 R3.1 | v13.97,31.62 14.73,32.38 36.58,32.38 37.97,30.99 43.31,30.99 44.43,29.86 U4.54
  Bottom 0.254: v13.97,31.62 v13.97,24.13
SD_D0  (via drill 0.25, 0.51)
  Top 0.254: J3.7 12.5,28.14 13.97,26.67 R2.1 19.47,27.85 v19.56,27.94 | v46.74,20.45 47.62,20.45 48.02,20.84 U4.39 | v46.61,22.35 46.1,21.84 40.89,21.84 39.5,23.24 39.5,25.4 38.35,26.54 34.16,26.54 33.53,26.54 33.02,27.05 31.88,27.05 31.62,26.8 v31.5,26.8
  Bottom 0.254: v19.56,27.94 26.16,27.94 26.92,28.7 29.59,28.7 v31.5,26.8 | v46.74,20.45 46.74,22.23 v46.61,22.35
SD_D1  (via drill 0.25, 0.51)
  Top 0.254: J3.8 14,29.24 15.24,30.48 17.02,30.48 18.29,29.21 R1.1 19.47,30.01 19.94,30.48 25.02,30.48 v25.78,29.72 | v32.51,26.16 32.77,25.91 38.23,25.91 38.99,25.15 38.99,22.99 40.64,21.34 U4.40
  Bottom 0.254: v25.78,29.72 26.29,29.21 30.35,29.21 32.51,27.05 v32.51,26.16
SD_D2  (via drill 0.25, 0.51)
  Top 0.254: U4.51 45.93,26.12 45.72,25.91 v43.69,25.91 | 19.56,19.14 R5.1 12.83,19.05 v10.41,21.46 5.89,21.46 J3.1 | v18.16,30.99 18.41,31.24 35.69,31.24 37.21,29.72 41.66,29.72 42.16,29.21 v43.18,29.21
  Bottom 0.254: v18.16,30.99 17.91,30.99 15.24,33.66 12.45,33.66 10.54,31.75 10.54,21.59 v10.41,21.46 | v43.69,25.91 43.69,28.7 v43.18,29.21
SD_D3  (via drill 0.25, 0.51)
  Top 0.254: J3.2 11.78,22.64 v11.81,22.61 11.81,22.48 13.97,20.32 16.51,20.32 17.78,21.59 R4.1 19.56,21.68 | v42.55,30.23 37.72,30.23 36.07,31.88 16.13,31.88 v15.75,31.5 | v45.09,31.62 45.43,31.28 U4.52
  Bottom 0.254: v45.09,31.62 43.94,31.62 v42.55,30.23 | v15.75,31.5 15.75,31.62 14.48,32.89 12.7,32.89 11.81,32 v11.81,22.61
SPKR+  (via drill 0.51)
  Top 0.254: v55.88,43.18 55.88,49.78 56.52,50.42 U6.8
  Bottom 0.254: J5.2 57.15,41.91 v55.88,43.18
SPKR-
  Top 0.254: J5.1 60.96,40.64 60.96,42.55 62.23,43.81 62.23,50.04 61.98,50.29 61.17,50.29 R10.2 59.43,50.38 U6.5
TRIG00
  Top 0.254: U4.14 35.48,18.84 34.04,17.4 34.04,15.49 33.4,14.86 25.02,14.86 24.51,15.37 24.51,16.09
TRIG01
  Top 0.254: U4.15 35.74,18.34 34.67,17.27 34.67,15.37 33.66,14.35 8.76,14.35 7.11,12.7
TRIG02
  Top 0.254: U4.16 36,17.84 35.31,17.14 35.31,15.24 33.91,13.84 11.56,13.84 10.41,12.7
TRIG03
  Top 0.254: 13.72,12.57 14.48,13.34 34.16,13.34 35.81,14.99 39.12,14.99 39.43,15.3 U4.17
TRIG04
  Top 0.254: U4.20 40.93,14.64 40.77,14.48 36.07,14.48 34.42,12.83 17.91,12.83 17.14,12.06
TRIG05
  Top 0.254: U4.21 41.43,14.38 41.02,13.97 36.32,13.97 34.67,12.32 21.34,12.32 20.45,11.43
TRIG06
  Top 0.254: U4.22 41.93,14.12 41.27,13.46 36.58,13.46 34.92,11.81 24.38,11.81 23.75,11.18
TRIG07
  Top 0.254: U4.23 42.43,13.86 41.53,12.95 36.83,12.95 35.18,11.3 27.69,11.3 27.05,10.67
TRIG08  (via drill 0.25)
  Top 0.254: U4.61 40.93,26.63 v41.91,25.65 | v30.48,9.02 30.48,9.27 30.99,9.78 31.71,9.78
  Bottom 0.254: v41.91,25.65 41.91,24.13 42.8,23.24 42.8,18.67 41.91,17.78 37.85,17.78 37.59,17.53 37.59,14.73 36.32,13.46 34.42,13.46 31.75,10.79 31.75,10.29 v30.48,9.02
TRIG09  (via drill 0.25)
  Top 0.254: U4.62 40.43,26.12 v40.77,25.78 | v30.61,10.54 30.86,10.79 34.67,10.79 35.05,10.41
  Bottom 0.254: v40.77,25.78 40.77,24.51 42.29,22.99 42.29,18.92 41.66,18.29 37.34,18.29 37.08,18.03 37.08,15.24 35.94,14.1 34.16,14.1 v30.61,10.54
TRIG10  (via drill 0.25)
  Top 0.254: U4.29 45.43,14.89 46.1,14.22 47.5,14.22 48.26,13.46 v48.26,11.81 | 38.35,10.79 v38.48,10.92
  Bottom 0.254: v48.26,11.81 48.26,11.3 47.12,10.16 39.24,10.16 v38.48,10.92
TRIG11  (via drill 0.25)
  Top 0.254: U4.44 45.31,23.34 v44.83,22.86
  Bottom 0.254: v41.66,11.05 42.42,11.05 45.09,13.72 45.09,22.61 v44.83,22.86
TRIG12  (via drill 0.25)
  Top 0.254: U4.45 45.88,23.84 v45.59,24.13
  Bottom 0.254: v44.96,11.3 44.96,12.83 45.59,13.46 v45.59,24.13
TRIG13  (via drill 0.25)
  Top 0.254: U4.46 50.34,24.34 v50.67,24 | 48.26,10.67 49.15,11.56 49.15,12.32 50.04,13.21 v52.2,13.21
  Bottom 0.254: v50.67,24 50.67,23.75 50.16,23.24 50.16,16.76 50.8,16.13 50.8,14.61 v52.2,13.21
TRIG14  (via drill 0.25)
  Top 0.254: v47.5,28.96 47.24,28.96 46.93,28.64 U4.49
  Bottom 0.254: v47.5,28.96 47.5,17.91 49.28,16.13 49.28,13.46 v51.56,11.18
TRIG15  (via drill 0.25, 0.51)
  Top 0.254: v48.51,29.84 48.01,30.35 47.12,30.35 46.43,29.67 U4.50
  Bottom 0.254: v48.51,29.84 48.51,17.65 49.91,16.26 49.91,14.22 52.2,11.94 54.1,11.94 v54.86,11.18
TXD  (via drill 0.51)
  Top 0.254: v52.07,21.84 50.93,21.84 50.43,22.34 U4.42 | v58.42,19.18 58.42,13.97 J4.5
  Bottom 0.254: v58.42,19.18 58.29,19.18 56.64,20.83 53.09,20.83 v52.07,21.84
VCC  (via drill 0.25, 0.51)
  Top 0.254: 40.51,46.61 41.02,47.12 U5.1 41.02,49.91 43.18,52.07 C21.2 | 36.45,47.12 36.45,48.59 U5.8 36.48,51.16 35.56,52.07 C27.2 34.89,53.76 33.66,54.99 SJ4.1 SJ4.2 29.34,54.99 28.96,54.61 28.96,53.98 28.32,53.34 C5.1 v27.56,51.82 | 36.45,47.12 35.47,46.14 C26.2 C22.1 | U5.20 41.02,46.1 40.51,46.61 | 23.75,38.48 24.13,38.1 28.03,38.1 28.79,38.86 | 23.75,38.48 23.75,39.33 C11.1 | 20.83,35.56 R17.1 18.67,35.52 18.67,34.67 18.41,34.42 10.29,34.42 8.76,32.89 5.59,32.89 4.06,31.37 1.78,31.37 1.4,30.99 1.4,26.04 2.67,24.77 4.06,24.77 | 20.83,35.56 23.75,38.48 | R5.2 R4.2 R3.2 R2.2 R1.2 v22.86,29.21 | v5.46,18.67 3.81,20.32 3.81,24.51 4.06,24.77 | J3.4 5.54,24.77 4.06,24.77 | 20.83,35.56 21.59,35.56 v22.1,35.05 | 28.79,38.86 C19.1 28.79,43.81 28.57,44.03 C12.1 27.94,45.21 27.62,45.53 U2.5 28.55,46.96 28.96,47.37 28.96,49.28 v28.83,49.4 | 28.79,38.86 v28.79,34.96 | v29.97,30.1 30.23,30.1 32.38,27.94 C18.1 35.18,27.9 35.18,27.3 35.43,27.05 38.48,27.05 38.77,27.34 U4.64 39.43,26.36 39.88,25.91 39.88,25.65 40.77,24.77 40.77,24.64 | 40.77,24.64 40.77,23.24 v41.27,22.73 | 40.77,24.64 41.02,24.89 43.94,24.89 44.39,25.34 U4.48 49.85,25.34 50.29,25.78 | v39.24,19.05 38.35,19.05 38.06,19.34 U4.13 34.58,19.34 34.04,18.8 33.27,18.8 33.02,18.54 C13.1 | v49.53,27.94 49.53,26.54 50.29,25.78 | 50.29,25.78 51.02,25.78 C10.1 | C9.1 43.98,11.47 44.7,12.19 v45.85,12.19 45.85,10.92 46.61,10.16 | 53.21,10.41 52.83,10.79 52.83,12.7 | 52.83,12.7 53.21,13.08 53.59,13.08 53.72,13.21 53.72,13.93 R19.1 53.76,14.99 | 53.76,14.99 R14.2 53.21,15.88 52.45,16.64 49.28,16.64 49.15,16.51 49.15,15.79 C15.1 49.12,15.68 48.26,15.68 v48.01,15.43 47.82,15.24 46.99,15.24 46.93,15.3 U4.32 46.93,17.2 45.21,18.92 42.04,18.92 41.91,19.05 v41.4,19.05 41.4,17.78 40.43,16.81 U4.19
  Top 0.254: v29.72,7.11 29.72,9.4 29.34,9.78 28.74,9.78 | 56.52,14.61 56.26,14.86 53.89,14.86 53.76,14.99 | 49.91,11.3 50.67,12.06 52.2,12.06 52.83,12.7 | 36.45,47.12 36.45,46.86 36.83,46.48 40.39,46.48 40.51,46.61
  Bottom 0.254: v49.53,27.94 57.15,27.94 58.42,29.21 60.96,29.21 | v22.86,29.21 22.86,34.29 v22.1,35.05 | 29.84,30.23 v29.97,30.1 29.97,33.27 28.79,34.46 v28.79,34.96 | v39.24,19.05 v41.4,19.05 41.66,19.3 41.66,20.19 41.27,20.57 v41.27,22.73 | v45.85,12.19 47.24,12.19 48.01,12.95 v48.01,15.43 48.26,15.68 | v15.37,11.18 v12.06,11.18 v8.76,11.18 8.76,15.37 v5.46,18.67 | v15.37,11.18 v18.8,11.18 v22.1,11.18 25.15,11.18 v25.4,10.92 25.91,10.92 26.29,10.54 26.29,7.37 26.8,6.86 29.46,6.86 v29.72,7.11 | v28.83,49.4 28.83,50.55 v27.56,51.82 | v16.76,16.13 16.76,12.57 v15.37,11.18
VIN
  Top 0.254: J1.VIN0 3.81,48.51 4.32,48.01 | 4.32,48.01 14.48,48.01 | 14.48,48.01 15.75,49.28 15.75,51.33 U1.3 | J9.2 1.27,44.96 4.32,48.01 | C1.1 15.24,39.37 14.48,40.13 12.7,41.91 12.7,46.23 14.48,48.01

### Text on the board
Bottom: v11
tPlace: LOAD | RUN | + | SPKR | - | WAV Trigger | 5V | VIN | GND | robertsonics | LR | 5V | BC | 3.3V | DI | PLO | MC | GND | I2S | BLK | GND | 5Vin | LED | RX | TX | T1 | T1 | T2 | T3 | T4 | T5 | T6 | T7 | T8 | T9 | T10 | T11 | T12 | T13 | T14 | T15 | T16 | GRN | GND | GND | Triggers | Triggers
bPlace: WAV Trigger
tNames: Jamie Robertson, Jordan McConnell